# EasyEDA schematic Photodiode plate.json
TITLE: Sheet_1; REV: 1.0; Date: 2024-04-13; Sheet: 1/1; Company: Your Company
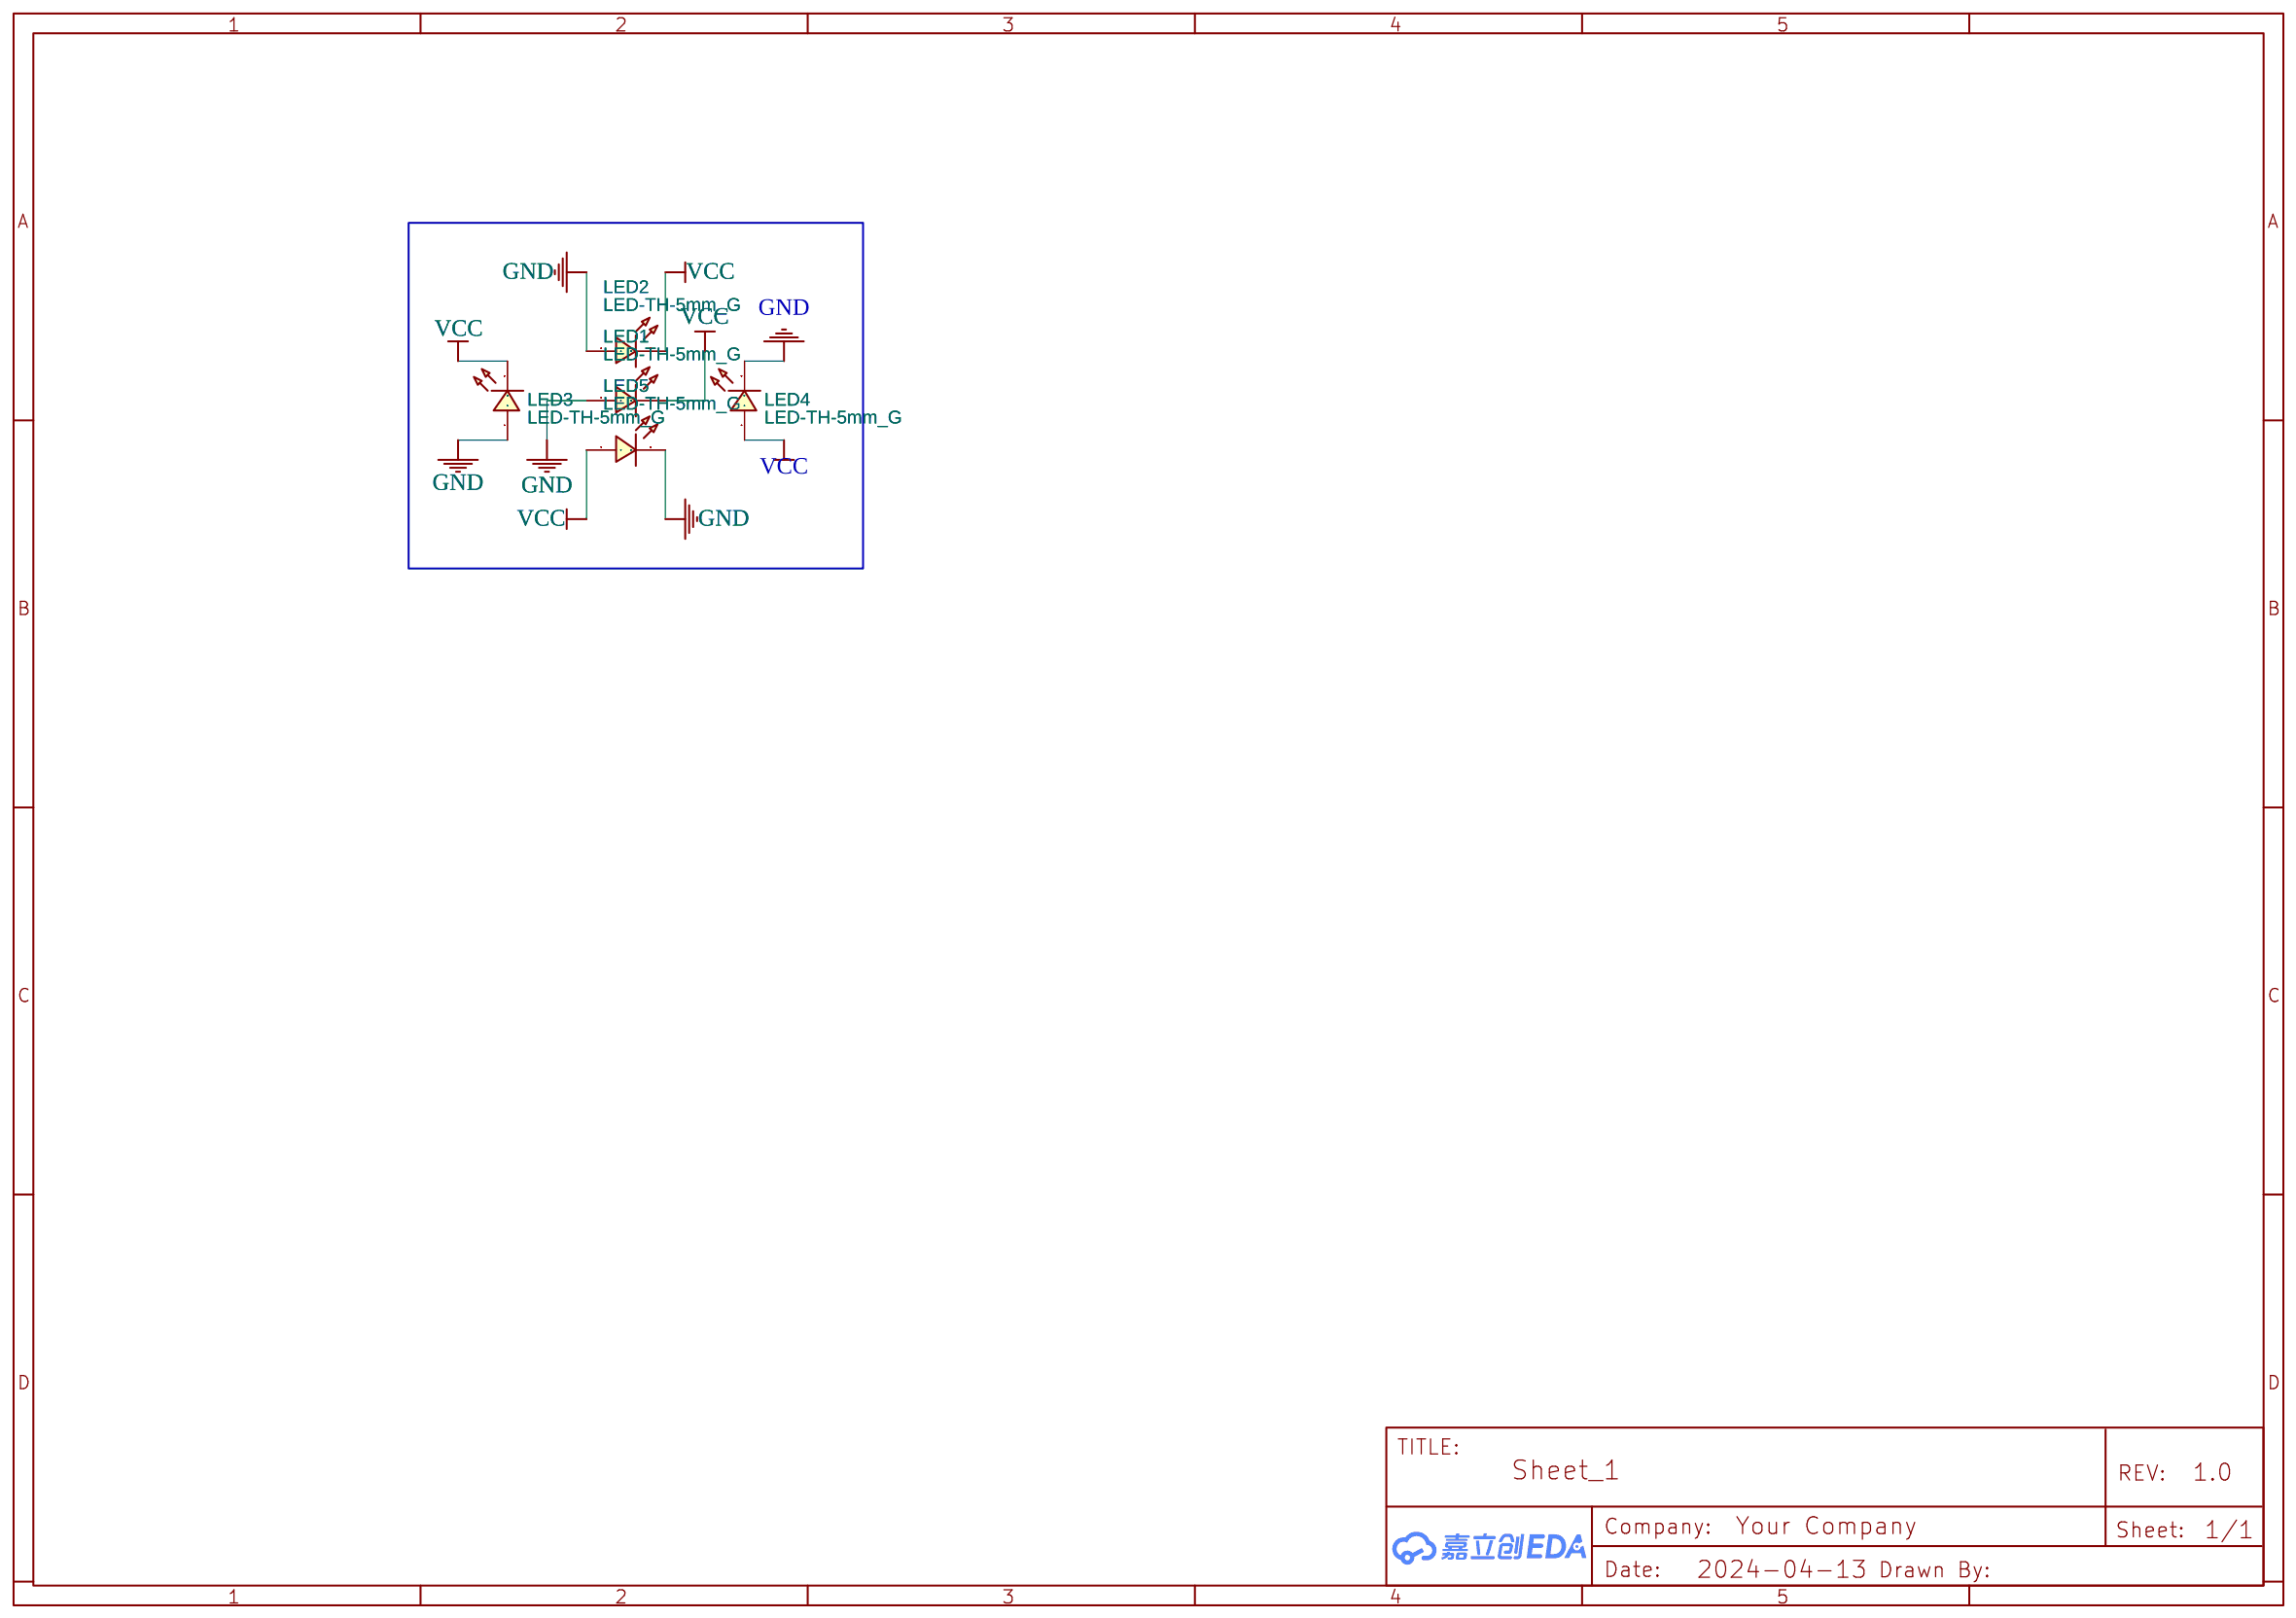
[diagram p0: schematic sheet]

## Parts
LED1  LED-TH-5mm_G  [LED-TH_BD5.0_GREEN]
LED2  LED-TH-5mm_G  [LED-TH_BD5.0_GREEN]
LED3  LED-TH-5mm_G  [LED-TH_BD5.0_GREEN]
LED4  LED-TH-5mm_G  [LED-TH_BD5.0_GREEN]
LED5  LED-TH-5mm_G  [LED-TH_BD5.0_GREEN]

## Library data of the parts
LED1-LED5 = LED-TH-5mm_G: Manufacturer: EVERLIGHT(台湾亿光); Manufacturer Part: 333-2SYGD/S530-E2; Supplier Part: C88163; Supplier: LCSC; Contributor: LCEDA_Lib

## Nets
GND: LED1.1 LED2.1 LED3.1 LED4.2 LED5.2
VCC: LED1.2 LED2.2 LED3.2 LED4.1 LED5.1
